# EasyEDA schematic schematic.json
TITLE: Sheet_2; REV: 1.0; Date: 2024-08-01; Sheet: 1/1; Drawn By: acidicts; Company: Your Company
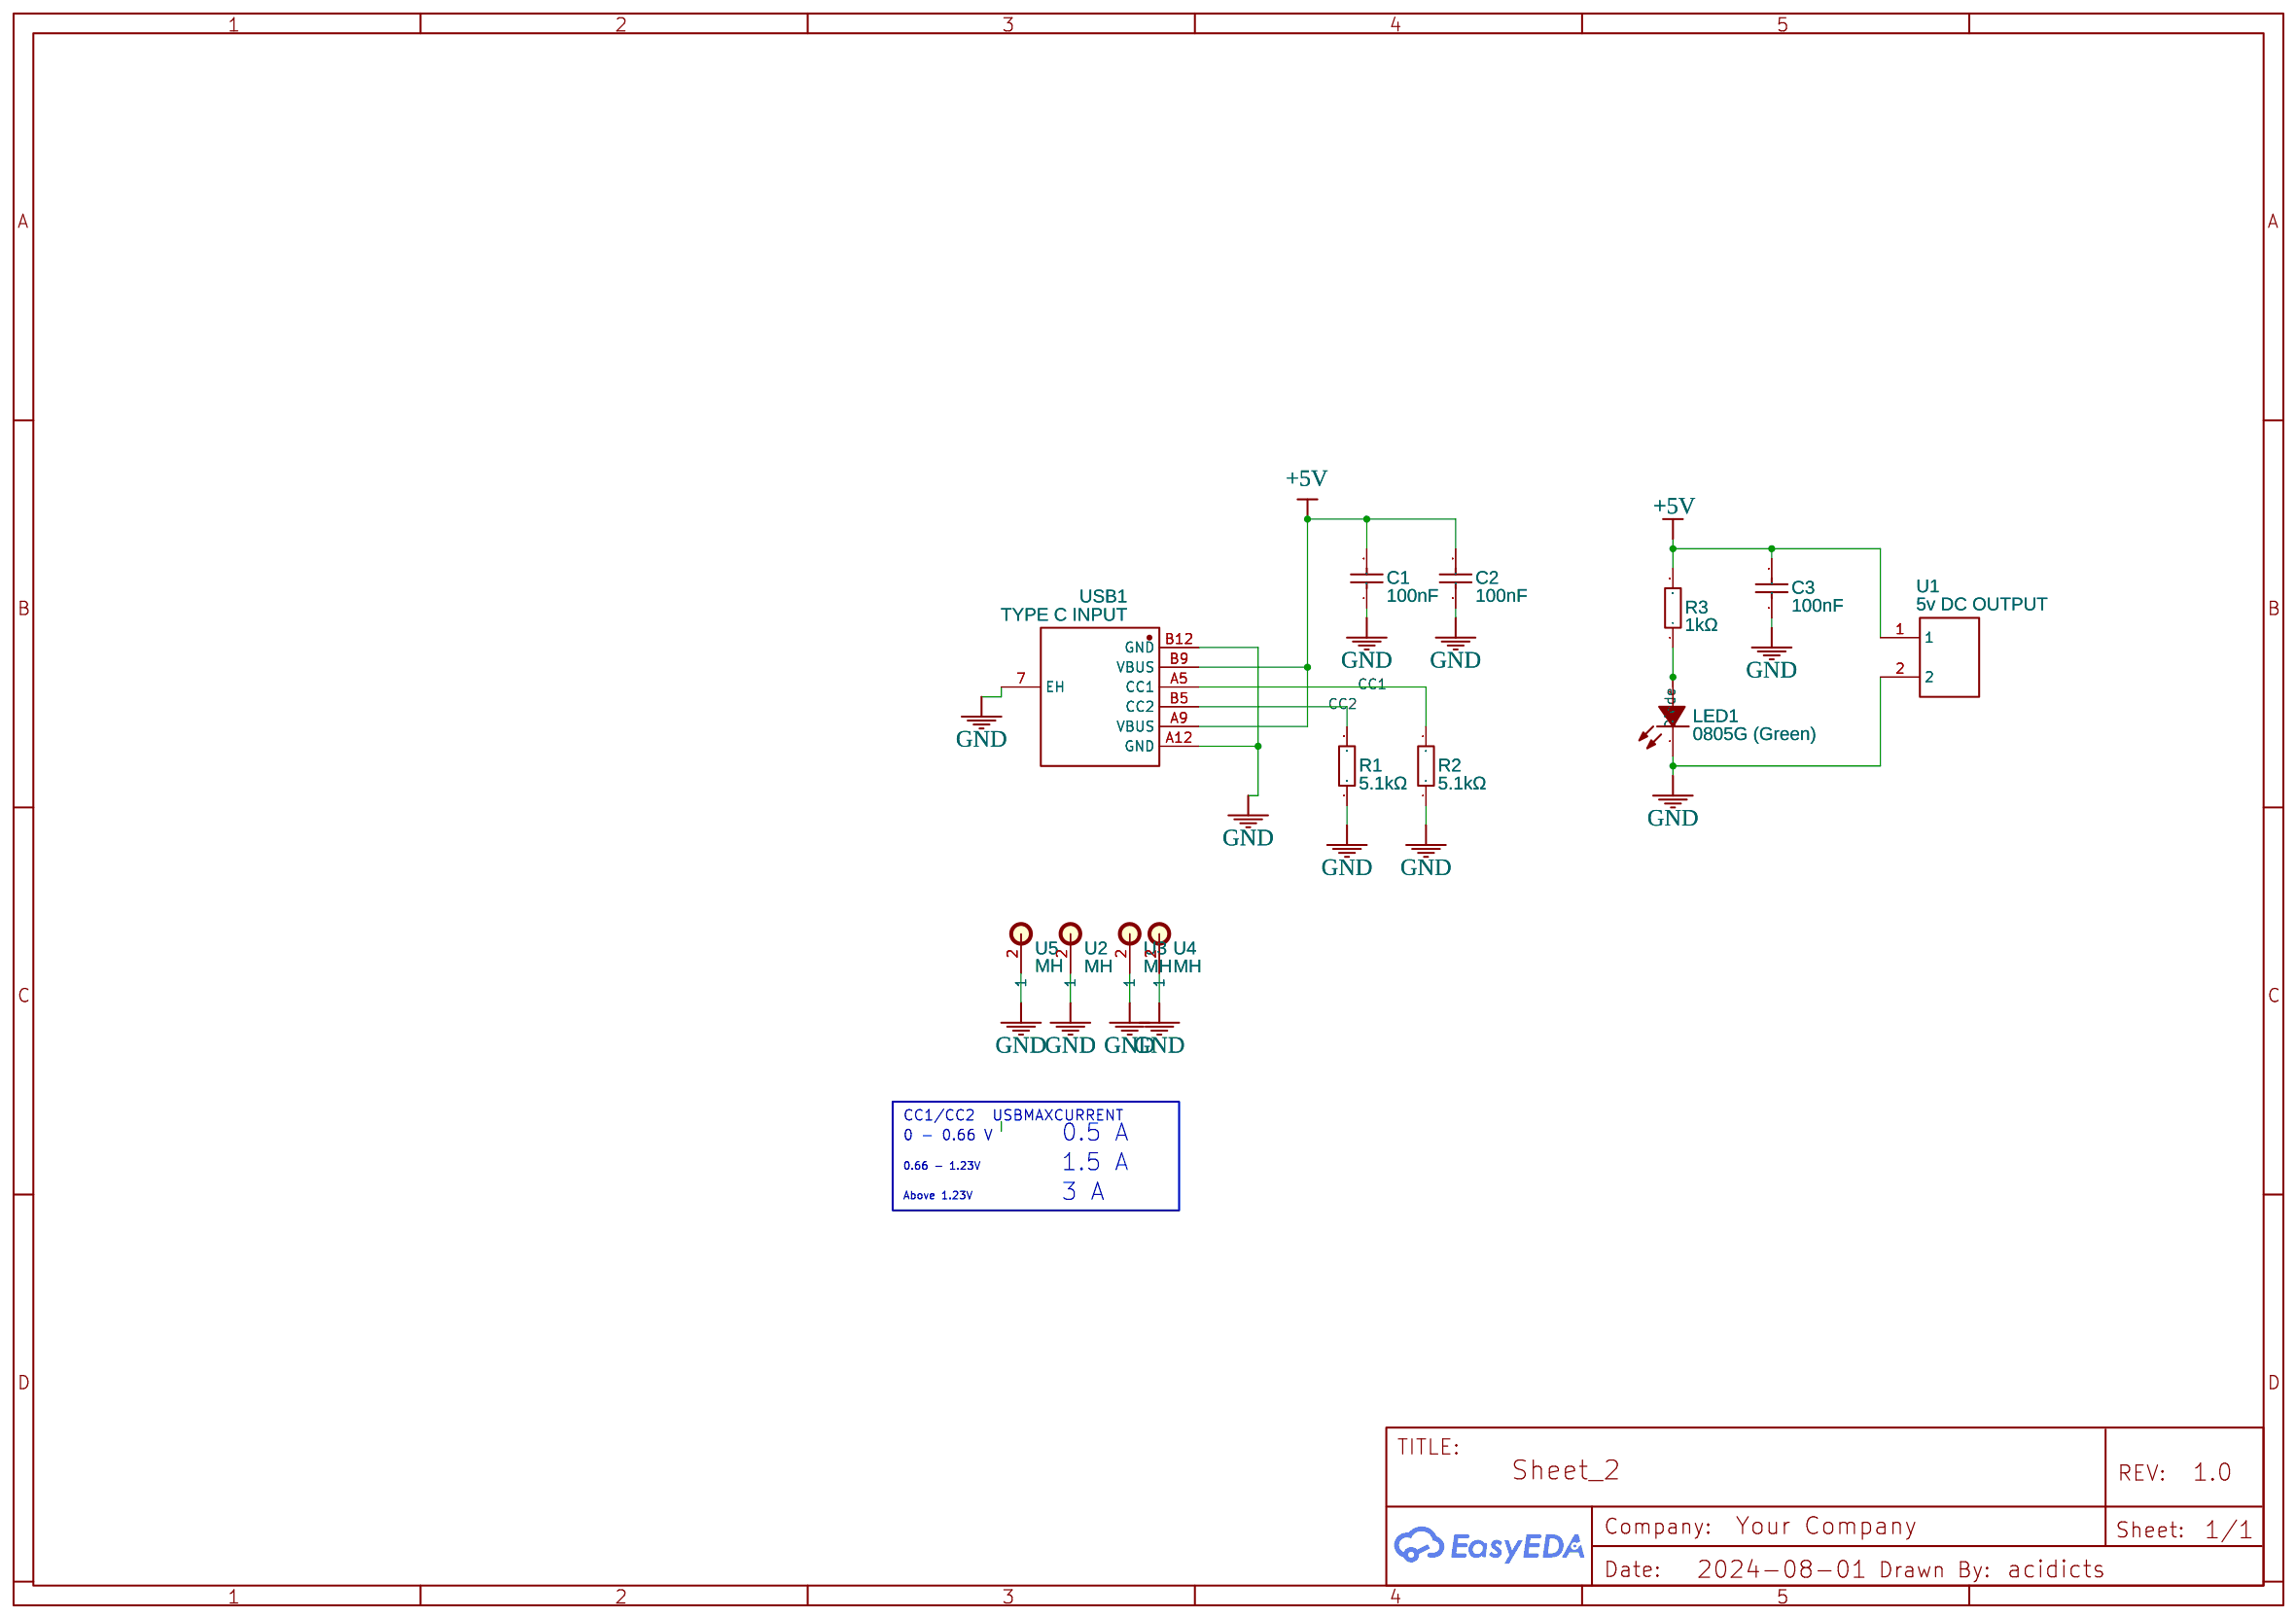
[diagram p0: schematic sheet]

## Parts
C1  100nF  [C0805]
C2  100nF  [C0805]
C3  100nF  [C0805]
LED1  0805G (Green)  [LED0805-R-RD]
R1  5.1kΩ  [R0805]
R2  5.1kΩ  [R0805]
R3  1kΩ  [R0805]
U1  5v DC OUTPUT  [CONN-TH_2P-P5.08_1729128]
U2  MH  [NEW_FOOTPRINT]
U3  MH  [NEW_FOOTPRINT]
U4  MH  [NEW_FOOTPRINT]
U5  MH  [NEW_FOOTPRINT]
USB1  TYPE C INPUT  [TYPE-C-SMD_TYPE-C-6P_5]

## Library data of the parts
C1-C3 = CL21B104KCFNNNE: Supplier: LCSC; Manufacturer: SAMSUNG(三星); Supplier Part: C28233; JLCPCB Part Class: Basic Part
LED1 = 0805G (Green): Supplier: LCSC; Manufacturer: KENTO; Manufacturer Part: KT-0805G; Supplier Part: C2297; JLCPCB Part Class: Basic Part
R1 R2 = 0805W8F5101T5E: Supplier: LCSC; Manufacturer: UNI-ROYAL(厚声); Supplier Part: C27834; JLCPCB Part Class: Basic Part
R3 = 0805W8F1001T5E: Supplier: LCSC; Manufacturer: UNI-ROYAL(厚声); Supplier Part: C17513; JLCPCB Part Class: Basic Part
U1 = MKDSN 1,5/ 2-5,08: Contributor: lcsc; Supplier: LCSC; Supplier Part: C5183989; Manufacturer: Phoenix Contact(菲尼克斯); JLCPCB Part Class: Extended Part
U2-U5 = New_Symbol: Contributor: acidicts
USB1 = TYPE-C 6P(073): Contributor: LCSC; Supplier: LCSC; Supplier Part: C668623; Manufacturer: SHOU HAN(首韩); JLCPCB Part Class: Extended Part

## Nets
+5V: C1.2 C2.2 C3.2 R3.2 U1.1 USB1.A9(VBUS) USB1.B9(VBUS)
GND: C1.1 C2.1 C3.1 LED1.2(K) R1.1 R2.1 U1.2 U2.2(1) U3.2(1) U4.2(1) U5.2(1) USB1.7(EH) USB1.A12(GND) USB1.B12(GND)
CC1: R2.2 USB1.A5(CC1)
CC2: R1.2 USB1.B5(CC2)
Diode: LED1.1(A) R3.1

## Notes on the sheet
- CC1/CC2
- USBMAXCURRENT
- 0 - 0.66 V
- 0.5 A
- 0.66 - 1.23V
- 1.5 A
- Above 1.23V
- 3 A
